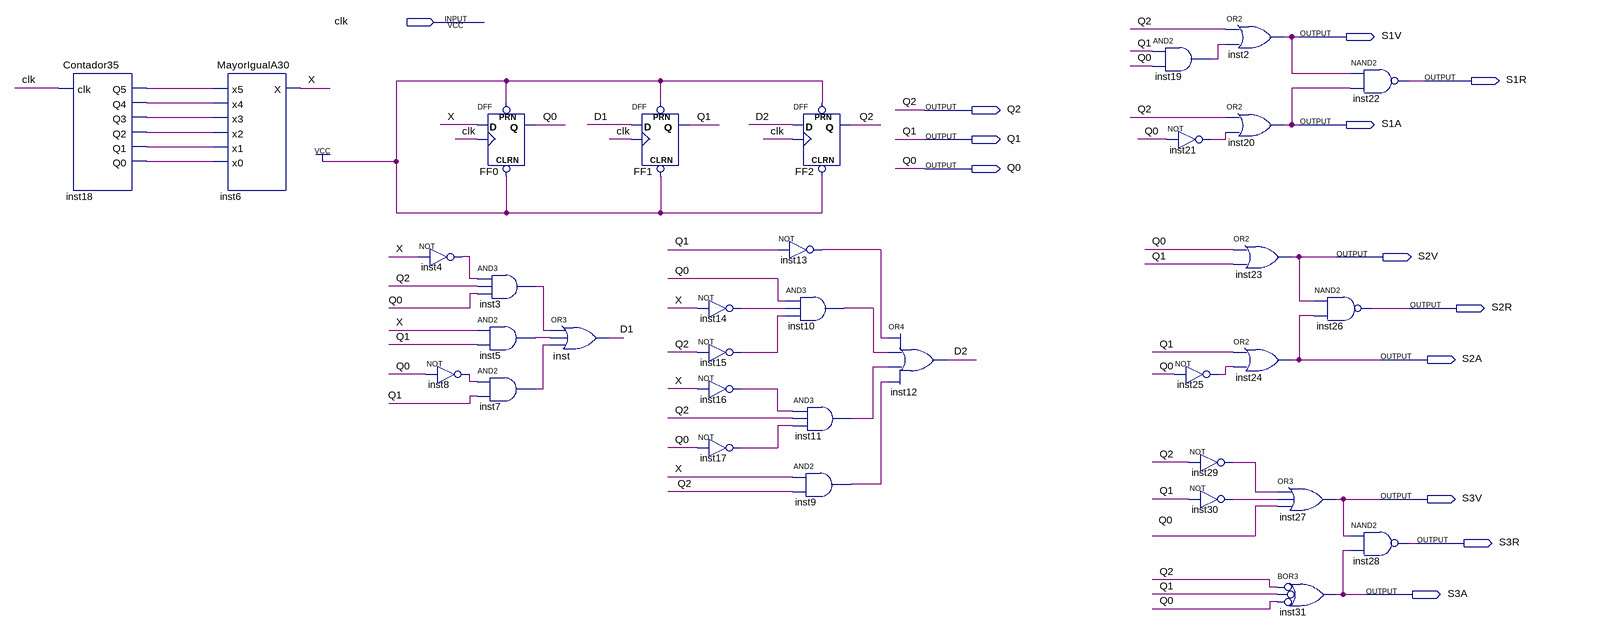
[diagram p0: schematic sheet]
// Quartus schematic MaquinaEstados.bdf as structural Verilog: 34 symbols, 13 pins
module MaquinaEstados (
  input  clk,
  output S1V,
  output S1R,
  output Q2,
  output S1A,
  output Q1,
  output Q0,
  output S2V,
  output S2R,
  output S2A,
  output S3V,
  output S3R,
  output S3A
);

  wire D1, D2, inst3_out, inst4_out, inst5_out, inst7_out, inst8_out, inst9_out, inst10_out, inst11_out,
       inst13_out, inst14_out, inst15_out, inst16_out, inst17_out, inst18_q0, inst18_q1, inst18_q2,
       inst18_q3, inst18_q4, inst18_q5, inst19_out, inst21_out, inst25_out, inst29_out, inst30_out, X;

  Contador35 inst18 (
    .clk(clk), .Q5(inst18_q5), .Q4(inst18_q4), .Q3(inst18_q3), .Q2(inst18_q2), .Q1(inst18_q1), .Q0(inst18_q0));
  MayorIgualA30 inst6 (
    .x5(inst18_q5), .x4(inst18_q4), .x3(inst18_q3), .x2(inst18_q2), .x1(inst18_q1), .x0(inst18_q0), .X(X));
  not inst4 (inst4_out, X);
  DFF FF0 (.CLRN(1'b1), .CLK(clk), .D(X), .PRN(1'b1), .Q(Q0));
  and inst3 (inst3_out, inst4_out, Q2, Q0);
  and inst5 (inst5_out, X, Q1);
  not inst8 (inst8_out, Q0);
  and inst7 (inst7_out, inst8_out, Q1);
  or inst (D1, inst3_out, inst5_out, inst7_out);
  DFF FF1 (.CLRN(1'b1), .CLK(clk), .D(D1), .PRN(1'b1), .Q(Q1));
  not inst14 (inst14_out, X);
  not inst15 (inst15_out, Q2);
  not inst16 (inst16_out, X);
  not inst17 (inst17_out, Q0);
  DFF FF2 (.CLRN(1'b1), .CLK(clk), .D(D2), .PRN(1'b1), .Q(Q2));
  not inst13 (inst13_out, Q1);
  and inst10 (inst10_out, Q0, inst14_out, inst15_out);
  and inst11 (inst11_out, inst16_out, Q2, inst17_out);
  and inst9 (inst9_out, X, Q2);
  or inst12 (D2, inst13_out, inst10_out, inst11_out, inst9_out);
  and inst19 (inst19_out, Q1, Q0);
  not inst21 (inst21_out, Q0);
  not inst25 (inst25_out, Q0);
  or inst2 (S1V, Q2, inst19_out);
  or inst20 (S1A, Q2, inst21_out);
  or inst23 (S2V, Q0, Q1);
  or inst24 (S2A, Q1, inst25_out);
  not inst29 (inst29_out, Q2);
  not inst30 (inst30_out, Q1);
  or inst27 (S3V, inst29_out, inst30_out, Q0);
  or inst31 (S3A, ~Q2, ~Q1, ~Q0);  // BOR3
  nand inst22 (S1R, S1V, S1A);
  nand inst26 (S2R, S2V, S2A);
  nand inst28 (S3R, S3V, S3A);
endmodule
